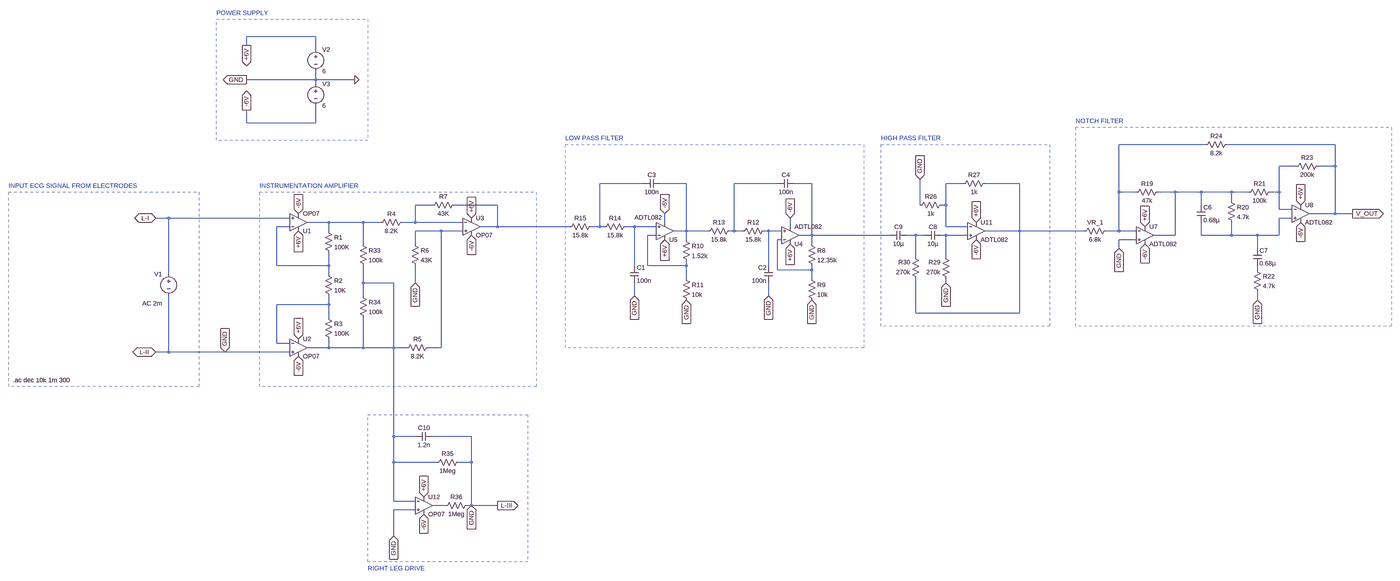
[diagram p0: schematic frequency_response.asc, whole sheet]
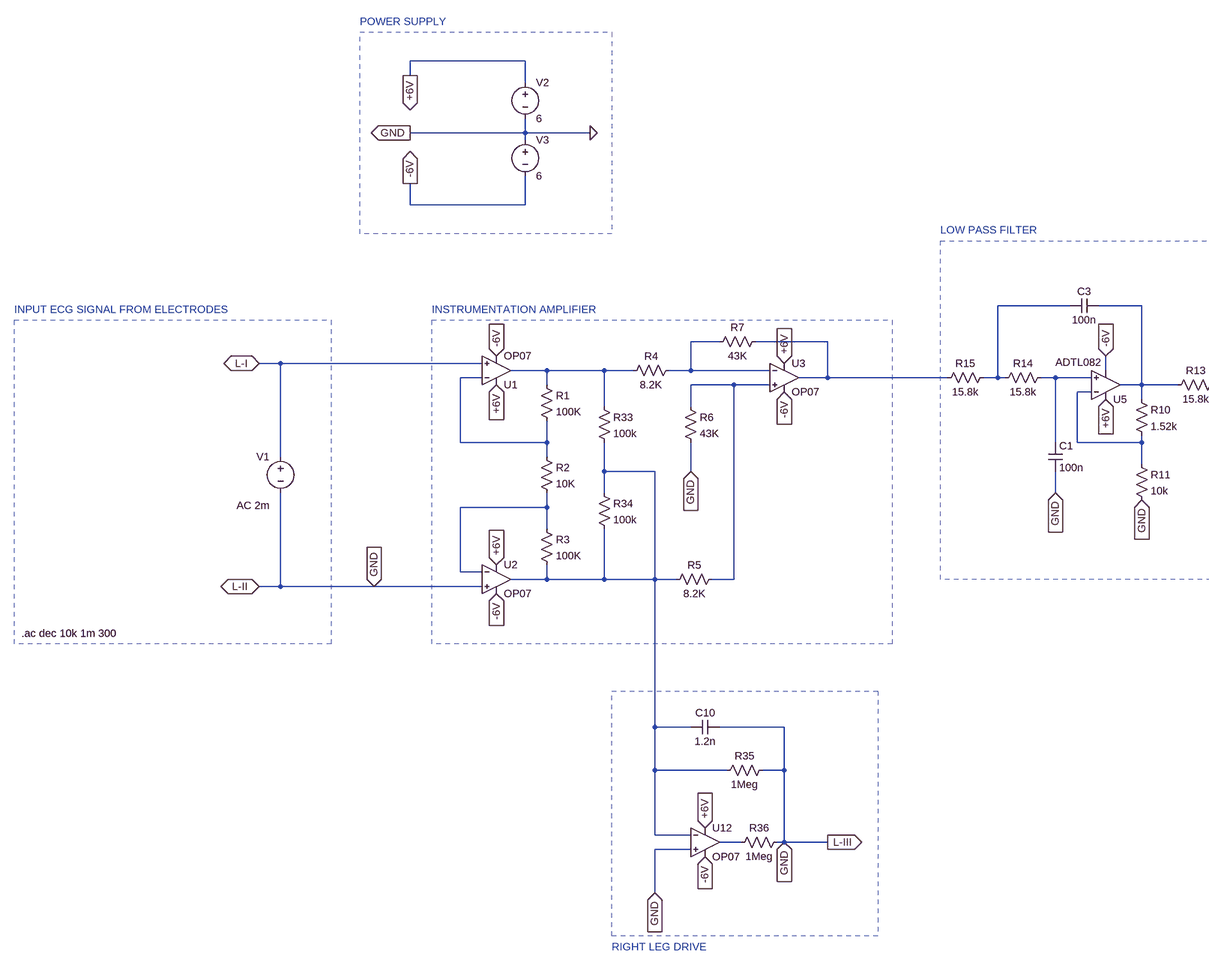
[diagram p1: schematic frequency_response.asc, part, row 1 of 1, column 1 of 2]
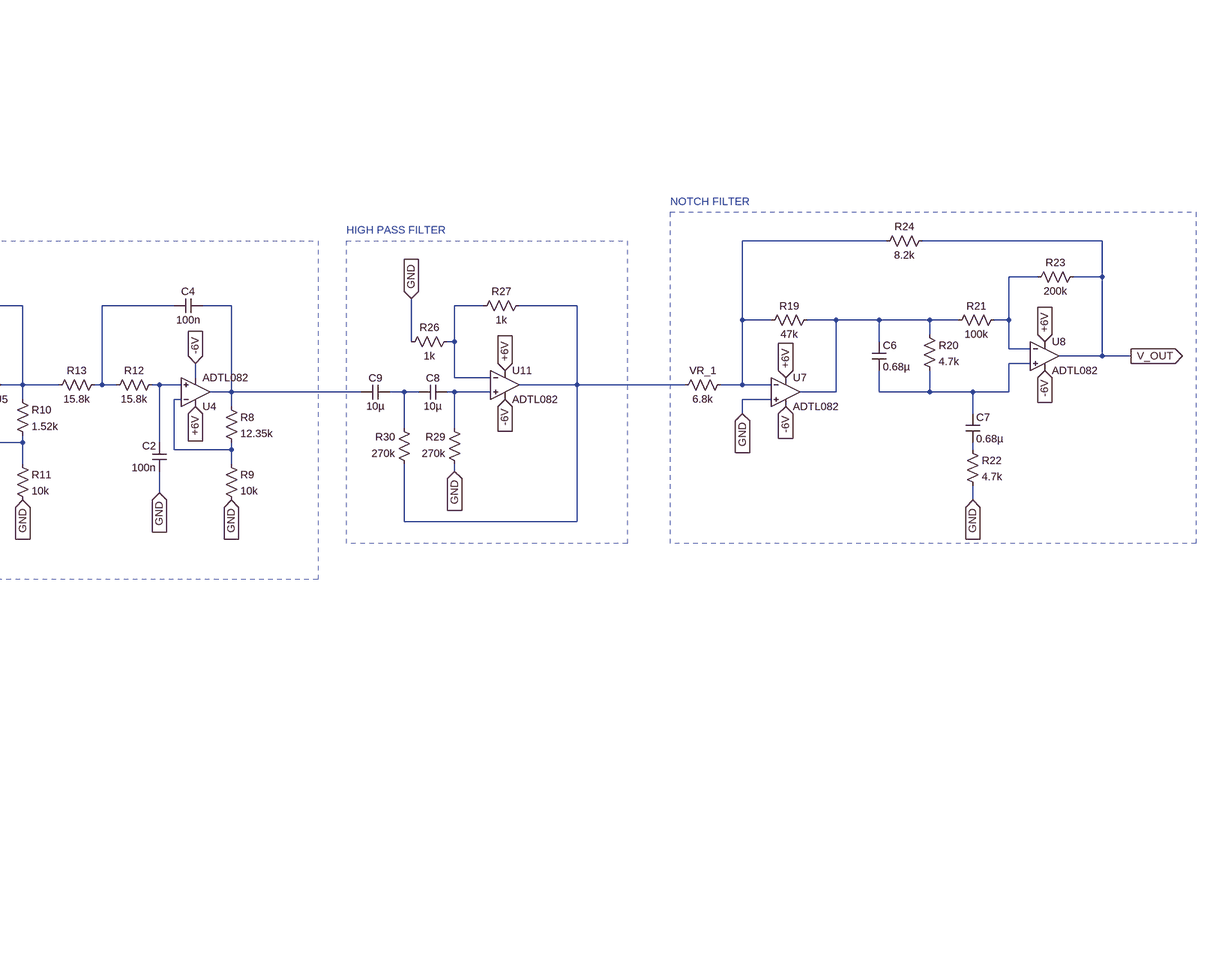
[diagram p2: schematic frequency_response.asc, part, row 1 of 1, column 2 of 2]
frequency_response.asc, the LTspice schematic file:
Version 4.1
SHEET 1 4228 1256
WIRE -576 -752 -832 -752
WIRE -832 -720 -832 -752
WIRE -576 -704 -576 -752
WIRE -576 -592 -576 -624
WIRE -576 -592 -832 -592
WIRE -432 -592 -576 -592
WIRE -576 -576 -576 -592
WIRE -832 -432 -832 -480
WIRE -576 -432 -576 -496
WIRE -576 -432 -832 -432
WIRE 2720 -352 2400 -352
WIRE 3200 -352 2800 -352
WIRE 3056 -272 2992 -272
WIRE 3200 -272 3200 -352
WIRE 3200 -272 3136 -272
WIRE 640 -208 480 -208
WIRE 800 -208 704 -208
WIRE 1136 -208 976 -208
WIRE 1264 -208 1200 -208
WIRE 1824 -208 1760 -208
WIRE 2032 -208 1904 -208
WIRE 2400 -176 2400 -352
WIRE 2464 -176 2400 -176
WIRE 2608 -176 2544 -176
WIRE 2704 -176 2608 -176
WIRE 2816 -176 2704 -176
WIRE 2880 -176 2816 -176
WIRE 2992 -176 2992 -272
WIRE 2992 -176 2960 -176
WIRE 2816 -144 2816 -176
WIRE -144 -128 -208 -128
WIRE 96 -128 -64 -128
WIRE 1664 -128 1664 -224
WIRE 1760 -128 1760 -208
WIRE 1760 -128 1744 -128
WIRE 2704 -128 2704 -176
WIRE 2992 -112 2992 -176
WIRE 3040 -112 2992 -112
WIRE 3200 -96 3200 -272
WIRE 3200 -96 3104 -96
WIRE 3264 -96 3200 -96
WIRE -1120 -80 -1168 -80
WIRE -672 -80 -1120 -80
WIRE 3040 -80 2992 -80
WIRE -528 -64 -608 -64
WIRE -400 -64 -528 -64
WIRE -336 -64 -400 -64
WIRE -208 -64 -208 -128
WIRE -208 -64 -256 -64
WIRE -32 -64 -208 -64
WIRE 720 -64 720 -96
WIRE -672 -48 -720 -48
WIRE 96 -48 96 -128
WIRE 96 -48 32 -48
WIRE 368 -48 96 -48
WIRE 480 -48 480 -208
WIRE 480 -48 448 -48
WIRE 496 -48 480 -48
WIRE 608 -48 576 -48
WIRE 688 -48 608 -48
WIRE 1184 -48 1184 -80
WIRE 1760 -48 1760 -128
WIRE 1840 -48 1760 -48
WIRE -528 -32 -528 -64
WIRE -112 -32 -208 -32
WIRE -32 -32 -112 -32
WIRE 800 -32 800 -208
WIRE 800 -32 752 -32
WIRE 880 -32 800 -32
WIRE 976 -32 976 -208
WIRE 976 -32 960 -32
WIRE 1008 -32 976 -32
WIRE 1104 -32 1088 -32
WIRE 1152 -32 1104 -32
WIRE 2032 -32 2032 -208
WIRE 2032 -32 1904 -32
WIRE 2272 -32 2032 -32
WIRE 2400 -32 2400 -176
WIRE 2400 -32 2352 -32
WIRE 2464 -32 2400 -32
WIRE 688 -16 656 -16
WIRE 1264 -16 1264 -208
WIRE 1264 -16 1216 -16
WIRE 1552 -16 1264 -16
WIRE 1648 -16 1616 -16
WIRE 1680 -16 1648 -16
WIRE 1760 -16 1744 -16
WIRE 1840 -16 1760 -16
WIRE 2608 -16 2608 -176
WIRE 2608 -16 2528 -16
WIRE 2704 -16 2704 -64
WIRE 2816 -16 2816 -64
WIRE 2816 -16 2704 -16
WIRE 2912 -16 2816 -16
WIRE 2992 -16 2992 -80
WIRE 2992 -16 2912 -16
WIRE 800 0 800 -32
WIRE 1152 0 1136 0
WIRE 2464 0 2400 0
WIRE -400 16 -400 -64
WIRE -208 16 -208 -32
WIRE 1264 16 1264 -16
WIRE 2400 32 2400 0
WIRE 2912 32 2912 -16
WIRE 1648 64 1648 -16
WIRE 1760 64 1760 -16
WIRE -720 96 -720 -48
WIRE -528 96 -528 48
WIRE -528 96 -720 96
WIRE 608 96 608 -48
WIRE 656 96 656 -16
WIRE 800 96 800 80
WIRE 800 96 656 96
WIRE 1104 96 1104 -32
WIRE 1136 112 1136 0
WIRE 1264 112 1264 96
WIRE 1264 112 1136 112
WIRE 2912 112 2912 96
WIRE -1120 128 -1120 -80
WIRE -528 128 -528 96
WIRE 800 144 800 96
WIRE 1264 144 1264 112
WIRE -400 160 -400 96
WIRE -288 160 -400 160
WIRE -208 160 -208 96
WIRE 1760 160 1760 144
WIRE -400 208 -400 160
WIRE 608 208 608 160
WIRE 1104 208 1104 160
WIRE 2912 224 2912 192
WIRE -528 240 -528 208
WIRE -528 240 -720 240
WIRE 1648 272 1648 144
WIRE 2032 272 2032 -32
WIRE 2032 272 1648 272
WIRE -528 288 -528 240
WIRE -720 384 -720 240
WIRE -672 384 -720 384
WIRE -528 400 -528 368
WIRE -528 400 -608 400
WIRE -400 400 -400 288
WIRE -400 400 -528 400
WIRE -288 400 -288 160
WIRE -288 400 -400 400
WIRE -240 400 -288 400
WIRE -112 400 -112 -32
WIRE -112 400 -160 400
WIRE -1120 416 -1120 208
WIRE -1120 416 -1168 416
WIRE -912 416 -1120 416
WIRE -672 416 -912 416
WIRE -288 752 -288 400
WIRE -208 752 -288 752
WIRE 0 752 -144 752
WIRE -288 848 -288 752
WIRE -128 848 -288 848
WIRE 0 848 0 752
WIRE 0 848 -48 848
WIRE -288 992 -288 848
WIRE -208 992 -288 992
WIRE -96 1008 -144 1008
WIRE 0 1008 0 848
WIRE 0 1008 -16 1008
WIRE 96 1008 0 1008
WIRE -208 1024 -288 1024
WIRE -288 1120 -288 1024
FLAG -640 -32 +6V
IOPIN -640 -32 In
FLAG -640 368 +6V
IOPIN -640 368 In
FLAG -640 -96 -6V
IOPIN -640 -96 In
FLAG -640 432 -6V
IOPIN -640 432 In
FLAG 0 -16 -6V
IOPIN 0 -16 In
FLAG 0 -80 +6V
IOPIN 0 -80 In
FLAG -1168 -80 L-I
IOPIN -1168 -80 BiDir
FLAG -1168 416 L-II
IOPIN -1168 416 BiDir
FLAG 720 0 +6V
IOPIN 720 0 In
FLAG 1184 16 +6V
IOPIN 1184 16 In
FLAG 720 -96 -6V
IOPIN 720 -96 In
FLAG 1184 -80 -6V
IOPIN 1184 -80 In
FLAG 2496 -48 +6V
IOPIN 2496 -48 In
FLAG 3072 -128 +6V
IOPIN 3072 -128 In
FLAG 2496 16 -6V
IOPIN 2496 16 In
FLAG 3072 -64 -6V
IOPIN 3072 -64 In
FLAG 1872 -64 +6V
IOPIN 1872 -64 In
FLAG 1872 0 -6V
IOPIN 1872 0 In
FLAG -832 -720 +6V
IOPIN -832 -720 Out
FLAG -832 -592 GND
IOPIN -832 -592 Out
FLAG -832 -480 -6V
IOPIN -832 -480 Out
FLAG -912 416 GND
IOPIN -912 416 In
FLAG -208 160 GND
IOPIN -208 160 In
FLAG 608 208 GND
IOPIN 608 208 In
FLAG 800 224 GND
IOPIN 800 224 In
FLAG 1104 208 GND
IOPIN 1104 208 In
FLAG 1264 224 GND
IOPIN 1264 224 In
FLAG 1664 -224 GND
IOPIN 1664 -224 In
FLAG 1760 160 GND
IOPIN 1760 160 In
FLAG 2400 32 GND
IOPIN 2400 32 In
FLAG 2912 224 GND
IOPIN 2912 224 In
FLAG -176 976 +6V
IOPIN -176 976 In
FLAG -176 1040 -6V
IOPIN -176 1040 In
FLAG -288 1120 GND
IOPIN -288 1120 In
FLAG 96 1008 L-III
IOPIN 96 1008 Out
FLAG 0 1008 GND
IOPIN 0 1008 In
FLAG -432 -592 0
FLAG 3264 -96 V_OUT
IOPIN 3264 -96 Out
SYMBOL OpAmps/OP07 -640 0 M180
SYMATTR InstName U1
SYMBOL Res -544 -48 R0
SYMATTR InstName R1
SYMATTR Value 100K
SYMBOL Res -544 112 R0
SYMATTR InstName R2
SYMATTR Value 10K
SYMBOL Res -544 272 R0
SYMATTR InstName R3
SYMATTR Value 100K
SYMBOL OpAmps/OP07 -640 336 R0
SYMATTR InstName U2
SYMBOL Voltage -1120 112 M0
WINDOW 123 24 124 Left 2
WINDOW 39 0 0 Left 0
SYMATTR Value2 AC 2m
SYMATTR InstName V1
SYMATTR Value ""
SYMBOL Res -240 -80 R90
WINDOW 0 0 56 VBottom 2
WINDOW 3 32 56 VTop 2
SYMATTR InstName R4
SYMATTR Value 8.2K
SYMBOL Res -144 384 R90
WINDOW 0 0 56 VBottom 2
WINDOW 3 32 56 VTop 2
SYMATTR InstName R5
SYMATTR Value 8.2K
SYMBOL Res -224 0 R0
SYMATTR InstName R6
SYMATTR Value 43K
SYMBOL ADTL082 1184 48 M180
SYMATTR InstName U4
SYMBOL ADTL082 720 32 M180
WINDOW 3 -112 114 Left 2
SYMATTR InstName U5
SYMBOL res 1248 0 R0
SYMATTR InstName R8
SYMATTR Value 12.35k
SYMBOL res 1248 128 R0
SYMATTR InstName R9
SYMATTR Value 10k
SYMBOL res 784 -16 R0
SYMATTR InstName R10
SYMATTR Value 1.52k
SYMBOL res 784 128 R0
SYMATTR InstName R11
SYMATTR Value 10k
SYMBOL cap 592 96 R0
SYMATTR InstName C1
SYMATTR Value 100n
SYMBOL cap 1120 96 M0
SYMATTR InstName C2
SYMATTR Value 100n
SYMBOL res 1104 -48 R90
WINDOW 0 0 56 VBottom 2
WINDOW 3 32 56 VTop 2
SYMATTR InstName R12
SYMATTR Value 15.8k
SYMBOL res 976 -48 R90
WINDOW 0 0 56 VBottom 2
WINDOW 3 32 56 VTop 2
SYMATTR InstName R13
SYMATTR Value 15.8k
SYMBOL res 592 -64 R90
WINDOW 0 0 56 VBottom 2
WINDOW 3 32 56 VTop 2
SYMATTR InstName R14
SYMATTR Value 15.8k
SYMBOL res 464 -64 R90
WINDOW 0 0 56 VBottom 2
WINDOW 3 32 56 VTop 2
SYMATTR InstName R15
SYMATTR Value 15.8k
SYMBOL cap 704 -224 R90
WINDOW 0 0 32 VBottom 2
WINDOW 3 32 32 VTop 2
SYMATTR InstName C3
SYMATTR Value 100n
SYMBOL cap 1200 -224 R90
WINDOW 0 0 32 VBottom 2
WINDOW 3 32 32 VTop 2
SYMATTR InstName C4
SYMATTR Value 100n
SYMBOL ADTL082 2496 -80 R0
SYMATTR InstName U7
SYMBOL ADTL082 3072 -160 R0
SYMATTR InstName U8
SYMBOL res 2368 -48 R90
WINDOW 0 0 56 VBottom 2
WINDOW 3 32 56 VTop 2
SYMATTR InstName VR_1
SYMATTR Value 6.8k
SYMATTR SpiceLine tol=5 pwr=0.25
SYMBOL res 2560 -192 R90
WINDOW 0 0 56 VBottom 2
WINDOW 3 32 56 VTop 2
SYMATTR InstName R19
SYMATTR Value 47k
SYMATTR SpiceLine tol=5 pwr=0.25
SYMBOL cap 2688 -128 R0
SYMATTR InstName C6
SYMATTR Value 0.68µ
SYMATTR SpiceLine V=50
SYMBOL res 2800 -160 R0
SYMATTR InstName R20
SYMATTR Value 4.7k
SYMATTR SpiceLine tol=5 pwr=0.25
SYMBOL res 2976 -192 R90
WINDOW 0 0 56 VBottom 2
WINDOW 3 32 56 VTop 2
SYMATTR InstName R21
SYMATTR Value 100k
SYMATTR SpiceLine tol=5 pwr=0.25
SYMBOL cap 2896 32 R0
SYMATTR InstName C7
SYMATTR Value 0.68µ
SYMATTR SpiceLine V=50
SYMBOL res 2896 96 R0
SYMATTR InstName R22
SYMATTR Value 4.7k
SYMATTR SpiceLine tol=5 pwr=0.25
SYMBOL res 3152 -288 R90
WINDOW 0 0 56 VBottom 2
WINDOW 3 32 56 VTop 2
SYMATTR InstName R23
SYMATTR Value 200k
SYMATTR SpiceLine tol=5 pwr=0.25
SYMBOL res 2816 -368 R90
WINDOW 0 0 56 VBottom 2
WINDOW 3 32 56 VTop 2
SYMATTR InstName R24
SYMATTR Value 8.2k
SYMATTR SpiceLine tol=5 pwr=0.25
SYMBOL cap 1744 -32 R90
WINDOW 0 0 32 VBottom 2
WINDOW 3 32 32 VTop 2
SYMATTR InstName C8
SYMATTR Value 10µ
SYMBOL cap 1616 -32 R90
WINDOW 0 0 32 VBottom 2
WINDOW 3 32 32 VTop 2
SYMATTR InstName C9
SYMATTR Value 10µ
SYMBOL res 1760 -144 R90
WINDOW 0 0 56 VBottom 2
WINDOW 3 32 56 VTop 2
SYMATTR InstName R26
SYMATTR Value 1k
SYMBOL res 1920 -224 R90
WINDOW 0 0 56 VBottom 2
WINDOW 3 32 56 VTop 2
SYMATTR InstName R27
SYMATTR Value 1k
SYMBOL res 1776 160 R180
WINDOW 0 36 76 Left 2
WINDOW 3 36 40 Left 2
SYMATTR InstName R29
SYMATTR Value 270k
SYMBOL res 1664 160 R180
WINDOW 0 36 76 Left 2
WINDOW 3 36 40 Left 2
SYMATTR InstName R30
SYMATTR Value 270k
SYMBOL ADTL082 1872 -96 R0
SYMATTR InstName U11
SYMBOL res -416 0 R0
SYMATTR InstName R33
SYMATTR Value 100k
SYMBOL res -416 192 R0
SYMATTR InstName R34
SYMATTR Value 100k
SYMBOL OpAmps/OP07 -176 944 R0
SYMATTR InstName U12
SYMBOL res -32 832 R90
WINDOW 0 0 56 VBottom 2
WINDOW 3 32 56 VTop 2
SYMATTR InstName R35
SYMATTR Value 1Meg
SYMBOL res 0 992 R90
WINDOW 0 0 56 VBottom 2
WINDOW 3 32 56 VTop 2
SYMATTR InstName R36
SYMATTR Value 1Meg
SYMBOL cap -144 736 R90
WINDOW 0 0 32 VBottom 2
WINDOW 3 32 32 VTop 2
SYMATTR InstName C10
SYMATTR Value 1.2n
SYMBOL voltage -576 -720 R0
WINDOW 123 0 0 Left 0
WINDOW 39 0 0 Left 0
SYMATTR InstName V2
SYMATTR Value 6
SYMBOL voltage -576 -592 R0
WINDOW 123 0 0 Left 0
WINDOW 39 0 0 Left 0
SYMATTR InstName V3
SYMATTR Value 6
SYMBOL OpAmps/OP07 0 -112 R0
SYMATTR InstName U3
SYMBOL Res -48 -144 R90
WINDOW 0 0 56 VBottom 2
WINDOW 3 32 56 VTop 2
SYMATTR InstName R7
SYMATTR Value 43K
TEXT -1712 -200 Left 2 ;INPUT ECG SIGNAL FROM ELECTRODES
TEXT -944 -840 Left 2 ;POWER SUPPLY
TEXT -784 -200 Left 2 ;INSTRUMENTATION AMPLIFIER
TEXT -384 1240 Left 2 ;RIGHT LEG DRIVE
TEXT 352 -376 Left 2 ;LOW PASS FILTER
TEXT 1520 -376 Left 2 ;HIGH PASS FILTER
TEXT 2240 -440 Left 2 ;NOTCH FILTER
TEXT -1696 520 Left 2 !.ac dec 10k 1m 300
RECTANGLE Normal -1008 544 -1712 -176 1
RECTANGLE Normal 240 544 -784 -176 1
RECTANGLE Normal 208 1216 -384 672 1
RECTANGLE Normal 1456 400 352 -352 1
RECTANGLE Normal 2144 320 1520 -352 1
RECTANGLE Normal 2240 -432 2240 -432 1
RECTANGLE Normal -384 -368 -944 -816 1
RECTANGLE Normal 3408 320 2240 -416 1

The netlist it stands for:
* frequency_response.asc
X§U1 L-I N014 +6V -6V N013 LT1001  ; OP07, pins In+ In- V+ V- OUT
R1 N013 N014 100K
R2 N014 N024 10K
R3 N024 N023 100K
X§U2 0 N024 +6V -6V N023 LT1001  ; OP07, pins In+ In- V+ V- OUT
V1 L-I 0 AC 2m
R4 N010 N013 8.2K
R5 N016 N023 8.2K
R6 N016 0 43K
X§U4 N017 N021 +6V -6V N006 ADTL082  ; pins In+ In- V+ V- OUT
X§U5 N015 N018 +6V -6V N004 ADTL082  ; pins In+ In- V+ V- OUT
R8 N006 N021 12.35k
R9 N021 0 10k
R10 N004 N018 1.52k
R11 N018 0 10k
C1 N015 0 100n
C2 N017 0 100n
R12 N017 N005 15.8k
R13 N005 N004 15.8k
R14 N015 N003 15.8k
R15 N003 N011 15.8k
C3 N004 N003 100n
C4 N006 N005 100n
X§U7 0 N001 +6V -6V N009 ADTL082  ; pins In+ In- V+ V- OUT
X§U8 N012 N002 +6V -6V V_OUT ADTL082  ; pins In+ In- V+ V- OUT
R§VR_1 N001 N008 6.8k tol=5 pwr=0.25
R19 N009 N001 47k tol=5 pwr=0.25
C6 N009 N012 0.68µ V=50
R20 N009 N012 4.7k tol=5 pwr=0.25
R21 N002 N009 100k tol=5 pwr=0.25
C7 N012 N022 0.68µ V=50
R22 N022 0 4.7k tol=5 pwr=0.25
R23 V_OUT N002 200k tol=5 pwr=0.25
R24 V_OUT N001 8.2k tol=5 pwr=0.25
C8 N020 N019 10µ
C9 N019 N006 10µ
R26 N007 0 1k
R27 N008 N007 1k
R29 0 N020 270k
R30 N008 N019 270k
X§U11 N020 N007 +6V -6V N008 ADTL082  ; pins In+ In- V+ V- OUT
R33 N013 N023 100k
R34 N023 N023 100k
X§U12 0 N023 +6V -6V N025 LT1001  ; OP07, pins In+ In- V+ V- OUT
R35 0 N023 1Meg
R36 0 N025 1Meg
C10 0 N023 1.2n
V2 +6V 0 6
V3 0 -6V 6
X§U3 N016 N010 +6V -6V N011 LT1001  ; OP07, pins In+ In- V+ V- OUT
R7 N011 N010 43K
* INPUT ECG SIGNAL FROM ELECTRODES
* POWER SUPPLY
* INSTRUMENTATION AMPLIFIER
* RIGHT LEG DRIVE
* LOW PASS FILTER
* HIGH PASS FILTER
* NOTCH FILTER
.ac dec 10k 1m 300
.lib LTC.lib
.lib ADI.lib
.backanno
.end